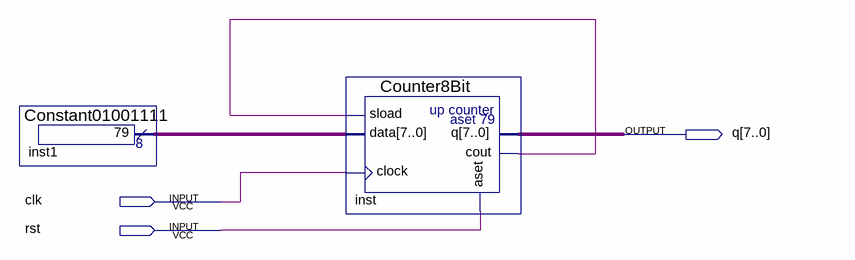
[diagram p0: schematic sheet]
// Quartus schematic FreqDev177.bdf as structural Verilog: 2 symbols, 3 pins
module FreqDev177 (
  input  clk,
  input  rst,
  output [7:0] q
);

  wire inst_cout;
  wire [7:0] inst1_result;

  Constant01001111 inst1 (.result(inst1_result));
  Counter8Bit inst (.sload(inst_cout), .data(inst1_result), .clock(clk), .aset(rst), .cout(inst_cout), .q(q));
endmodule
